# EAGLE design atmega16a_with_lcd (EAGLE 7.1.0)
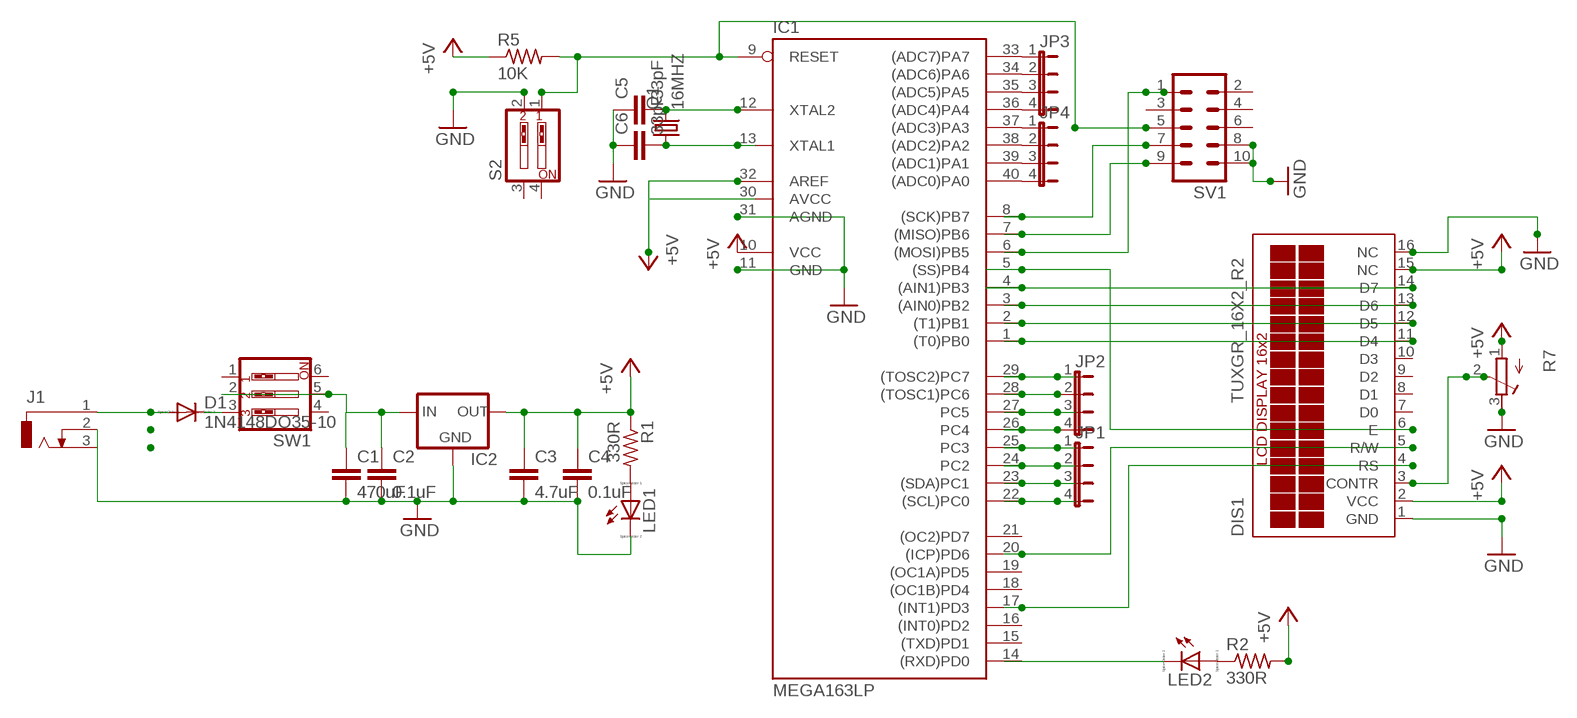
[diagram p0: schematic, sheet 1]

## Parts
C1  470uF  C2.5/4  [C2.5-4]
C2  0.1uF  C2.5/4  [C2.5-4]
C3  4.7uF  C2.5/4  [C2.5-4]
C4  0.1uF  C2.5/4  [C2.5-4]
C5  33pF  C2.5/4  [C2.5-4]
C6  33pF  C2.5/4  [C2.5-4]
D1  1N4148DO35-10  [DO35-10]
DIS1  TUXGR_16X2_R2  [TUXGR_16X2_R2]
IC1  MEGA163LP  [DIL40]
IC2  78XXS  [78XXS]
J1  DCJ0303  [DCJ0303]
JP1  JP4E  [JP4]
JP2  JP4E  [JP4]
JP3  JP4E  [JP4]
JP4  JP4E  [JP4]
LED1  LED_ELD260  [LED_LD260]
LED2  LED_ELD260  [LED_LD260]
Q1  16MHZ  CRYSTALHC49U-V  [HC49U-V]
R1  330R  R-US_0204/7  [0204/7]
R2  330R  R-US_0204/7  [0204/7]
R5  10K  R-US_0204/7  [0204/7]
R7  R-TRIMM3339P  [RTRIM3339P]
S2  SW_DIP-2  [EDG-02]
SV1  MA05-2  [MA05-2]
SW1  SW_DIP-3  [EDG-03]

## Nets
+5V: C3.1 C4.1 DIS1.2(VCC) DIS1.15(NC) IC1.10(VCC) IC1.32(AREF) IC2.OUT R1.1 R2.2 R5.1 R7.1(E)
GND: C1.2 C2.2 C3.2 C4.2 C5.1 C6.1 DIS1.1(GND) DIS1.16(NC) IC1.11(GND) IC1.31(AGND) IC2.GND J1.2 J1.3 LED1.K(C) R7.3(A) S2.2 SV1.8 SV1.10
N$1: D1.A J1.1
N$2: IC1.29((TOSC2)PC7) JP2.1
N$3: C5.2 IC1.12(XTAL2) Q1.2
N$4: C6.2 IC1.13(XTAL1) Q1.1
N$5: LED1.A R1.2
N$6: IC1.9(RESET) R5.2 S2.1 SV1.5
N$7: DIS1.3(CONTR) R7.2(S)
N$8: D1.C SW1.3
N$9: C1.1 C2.1 IC2.IN SW1.2 SW1.5
N$10: DIS1.11(D4) IC1.1((T0)PB0)
N$11: DIS1.12(D5) IC1.2((T1)PB1)
N$12: DIS1.13(D6) IC1.3((AIN0)PB2)
N$13: DIS1.14(D7) IC1.4((AIN1)PB3)
N$14: DIS1.4(RS) IC1.17((INT1)PD3)
N$15: DIS1.5(R/W) IC1.20((ICP)PD6)
N$16: DIS1.6(E) IC1.5((SS)PB4)
N$17: IC1.28((TOSC1)PC6) JP2.2
N$18: IC1.27(PC5) JP2.3
N$19: IC1.26(PC4) JP2.4
N$20: IC1.25(PC3) JP1.1
N$21: IC1.24(PC2) JP1.2
N$22: IC1.23((SDA)PC1) JP1.3
N$23: IC1.22((SCL)PC0) JP1.4
N$24: IC1.6((MOSI)PB5) SV1.1
N$25: IC1.7((MISO)PB6) SV1.9
N$26: IC1.8((SCK)PB7) SV1.7
N$27: IC1.14((RXD)PD0) LED2.K(C)
N$29: IC1.33((ADC7)PA7) JP3.1
N$30: IC1.34((ADC6)PA6) JP3.2
N$31: IC1.35((ADC5)PA5) JP3.3
N$32: IC1.36((ADC4)PA4) JP3.4
N$33: IC1.37((ADC3)PA3) JP4.1
N$34: IC1.38((ADC2)PA2) JP4.2
N$35: IC1.39((ADC1)PA1) JP4.3
N$36: IC1.40((ADC0)PA0) JP4.4
N$37: LED2.A R2.1
Unconnected: DIS1.7(D0) DIS1.8(D1) DIS1.9(D2) DIS1.10(D3) IC1.15((TXD)PD1) IC1.16((INT0)PD2) IC1.18((OC1B)PD4) IC1.19((OC1A)PD5) IC1.21((OC2)PD7) S2.3 S2.4 SV1.2 SV1.3 SV1.4 SV1.6 SW1.1 SW1.4 SW1.6

## Power pins joined to a net without a drawn wire
AVCC: IC1.30(AVCC)

## Library data of the parts
C1-C6 = capacitor-wima:C: CAPACITOR naming: grid - package width
D1 = diode:1N4148: DIODE high speed (Philips)
DIS1 = display-lcd:TUXGR_16X2_R2: Tuxgraphics LCD display 16x2 characters reflective, without background light Source: tuxgr_12x2_r2.pdf; OC_FARNELL: unknown; OC_NEWARK: unknown
IC1 = atmel:MEGA163*P: MICROCONTROLLER 16 Kbytes FLASH 1 Kbytes EEPROM 1 Kbytes SRAM UART 8-channel 10 bit ADC hardware multiplier Source: avr.lbr; OC_FARNELL: unknown; OC_NEWARK: unknown
IC2 = v-reg:78XXS: VOLTAGE REGULATOR
J1 = con-jack:DCJ0303: DC POWER JACK Source: DCJ0303.pdf; OC_FARNELL: unknown; OC_NEWARK: unknown
JP1-JP4 = jumper:JP4E: JUMPER
LED1 LED2 = eagle-ltspice:LED_E: LED Source: http://www.osram.convergy.de Source: www.luxeon.com Source: www.kingbright.com; SPICEMODEL: NONE; SPICEPREFIX: D; SPICETYPE: diode
Q1 = crystal:CRYSTAL: CRYSTAL; OC_FARNELL: 1666969; OC_NEWARK: unknown
R1 R2 R5 = resistor:R-US_: RESISTOR, American symbol
R7 = resistor:R-TRIMM: Trimm resistor
S2 = special:SW_DIP-2: DIP SWITCH
SV1 = con-lstb:MA05-2: PIN HEADER; OC_FARNELL: unknown; OC_NEWARK: unknown
SW1 = special:SW_DIP-3: DIP SWITCH

## Board
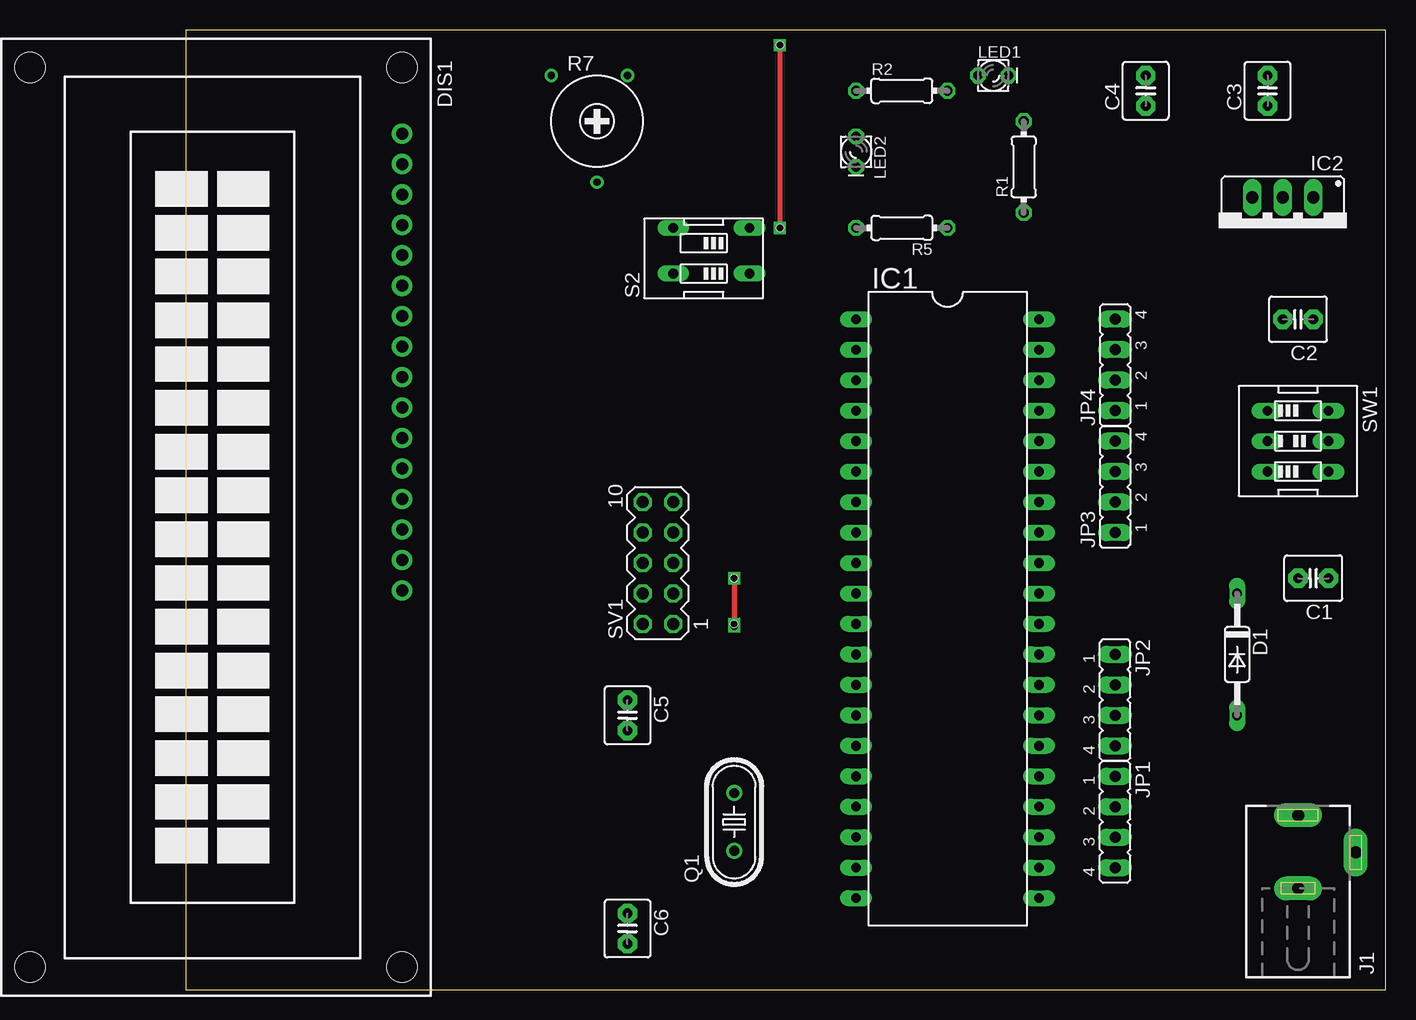
[diagram p1: board, top side]
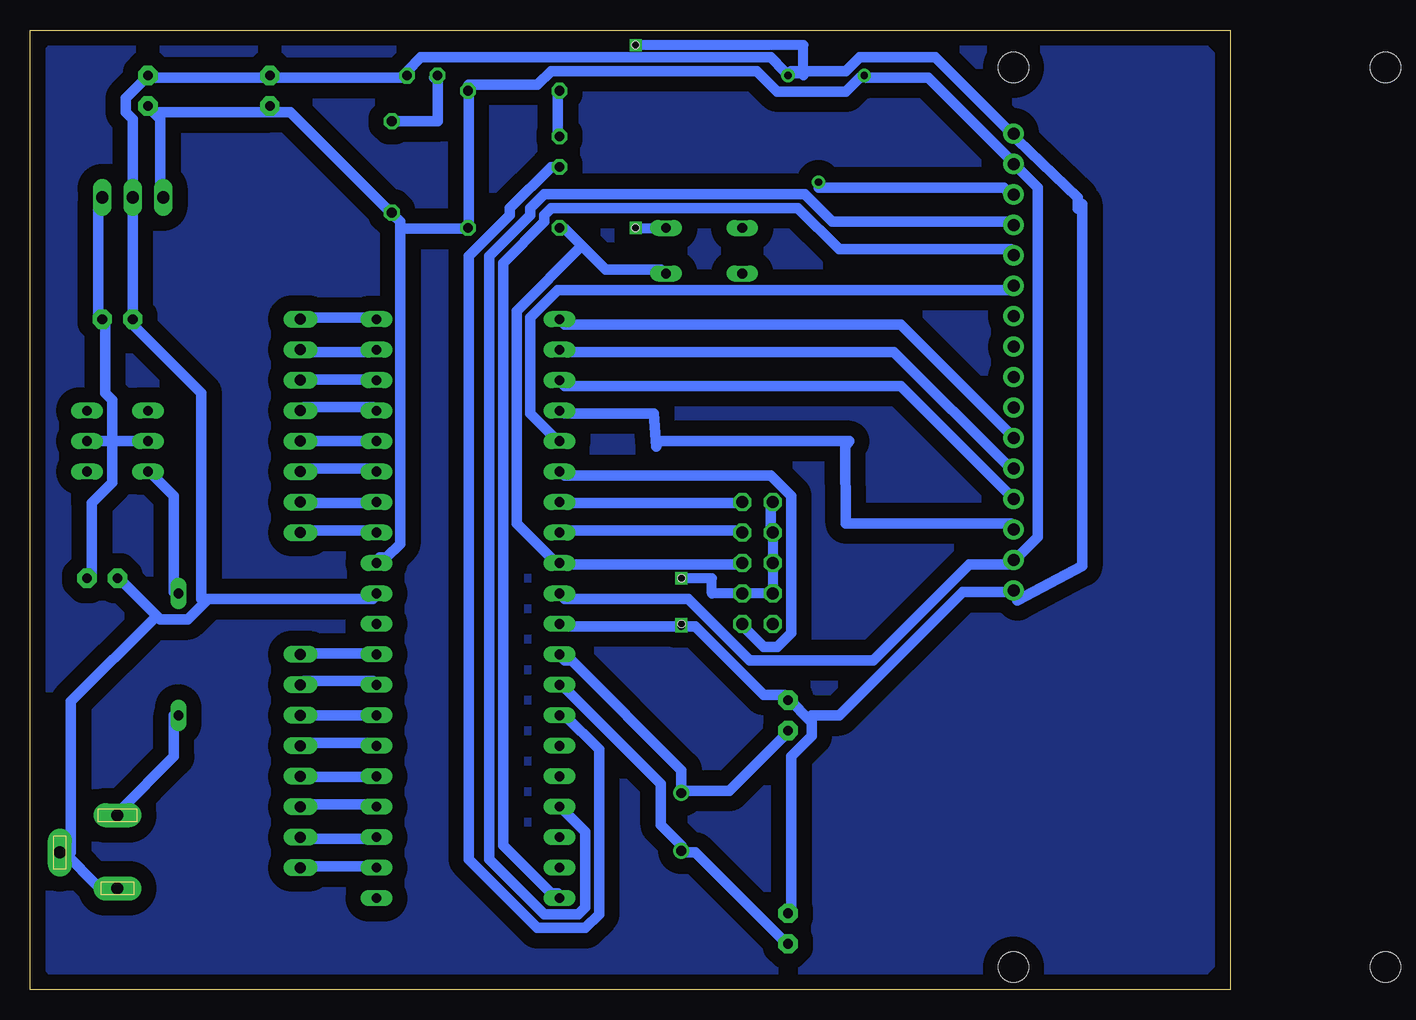
[diagram p2: board, bottom side, seen from below]

Size 100 x 80 mm. Coordinates in mm from the lower left corner, seen from the top.
Outline: 0,0 100,0 100,80 0,80 0,0
Copper layers (1*16): Top 0.035mm / dielectric 1.5mm / Bottom 0.035mm
Design rules "default *": minimum track width 35mil, minimum drill 24mil, track to track 10mil, track to pad 8mil, pad to pad 8mil, via to via 8mil, smd to smd 8mil, copper to edge 50mil, drill to drill 8mil, minimum pad ring 10mil, minimum via ring 8mil, stop-mask expansion 4mil, vias tented up to drill 0mil, thermal gap 10mil
Holes 0.6 mm at 45.72,30.48 45.72,34.29 49.53,63.5 49.53,78.74

### Footprints (pad centres in the part's own frame; a part is rotated, then mirrored left to right if it is on the bottom)
C2.5-4 = drill 0.813 pad 1.6 octagon: 1 -1.27,0; 2 1.27,0
DO35-10 = drill 0.813 long: A 5.08,0; C -5.08,0
TUXGR_16X2_R2 = drill 1 pad 1.676: 1 -32,15.5; 2 -29.46,15.5; 3 -26.92,15.5; 4 -24.38,15.5; 5 -21.84,15.5; 6 -19.3,15.5; 7 -16.76,15.5; 8 -14.22,15.5; 9 -11.68,15.5; 10 -9.14,15.5; 11 -6.6,15.5; 12 -4.06,15.5; 13 -1.52,15.5; 14 1.02,15.5; 15 3.56,15.5; 16 6.1,15.5 | hole 2.5: -37.5,-15.5; 37.5,-15.5; -37.5,15.5; 37.5,15.5
DIL40 = drill 0.813 long: 1 -24.13,-7.62; 2 -21.59,-7.62; 3 -19.05,-7.62; 4 -16.51,-7.62; 5 -13.97,-7.62; 6 -11.43,-7.62; 7 -8.89,-7.62; 8 -6.35,-7.62; 9 -3.81,-7.62; 10 -1.27,-7.62; 11 1.27,-7.62; 12 3.81,-7.62; 13 6.35,-7.62; 14 8.89,-7.62; 15 11.43,-7.62; 16 13.97,-7.62; 17 16.51,-7.62; 18 19.05,-7.62; 19 21.59,-7.62; 20 24.13,-7.62; 21 24.13,7.62; 22 21.59,7.62; 23 19.05,7.62; 24 16.51,7.62; 25 13.97,7.62; 26 11.43,7.62; 27 8.89,7.62; 28 6.35,7.62; 29 3.81,7.62; 30 1.27,7.62; 31 -1.27,7.62; 32 -3.81,7.62; 33 -6.35,7.62; 34 -8.89,7.62; 35 -11.43,7.62; 36 -13.97,7.62; 37 -16.51,7.62; 38 -19.05,7.62; 39 -21.59,7.62; 40 -24.13,7.62
78XXS = drill 1.016 long: GND 0,-2.54; IN -2.54,-2.54; OUT 2.54,-2.54
DCJ0303 = drill 1 pad 2 long: 1 0,3.1; 2 4.8,0; 3 0,-3
JP4 = drill 0.914 long: 1 -3.81,0; 2 -1.27,0; 3 1.27,0; 4 3.81,0
LED_LD260 = drill 0.813 octagon: A -1.27,0; K 1.27,0
HC49U-V = drill 0.813: 1 -2.413,0; 2 2.413,0
0204/7 = drill 0.813 octagon: 1 -3.81,0; 2 3.81,0
RTRIM3339P = drill 0.61: 1 -3.81,3.81; 2 0,-5.08; 3 2.54,3.81
EDG-02 = drill 0.813 long: 1 -1.27,-3.81; 2 2.54,-3.81; 3 2.54,2.54; 4 -1.27,2.54
MA05-2 = drill 1.016 octagon: 1 -5.08,-1.27; 2 -5.08,1.27; 3 -2.54,-1.27; 4 -2.54,1.27; 5 0,-1.27; 6 0,1.27; 7 2.54,-1.27; 8 2.54,1.27; 9 5.08,-1.27; 10 5.08,1.27
EDG-03 = drill 0.813 long: 1 -2.54,-2.54; 2 0,-2.54; 3 2.54,-2.54; 4 2.54,2.54; 5 0,2.54; 6 -2.54,2.54

### Placement (x,y rotation side)
C1  93.98,34.29 180 top
C2  92.71,55.88 180 top
C3  90.17,74.93 90 top
C4  80.01,74.93 90 top
C5  36.83,22.86 270 top
C6  36.83,5.08 270 top
D1  87.63,27.94 270 top
DIS1  2.54,39.37 270 top
IC1  63.5,31.75 270 top
IC2  91.44,63.5 180 top
J1  92.71,11.43 0 top
JP1  77.47,13.97 270 top
JP2  77.47,24.13 270 top
JP3  77.47,41.91 90 top
JP4  77.47,52.07 90 top
LED1  67.31,76.2 0 top
LED2  55.88,69.85 270 top
Q1  45.72,13.97 90 top
R1  69.85,68.58 90 top
R2  59.69,74.93 0 top
R5  59.69,63.5 180 top
R7  34.29,72.39 0 top
S2  43.18,60.96 90 top
SV1  39.37,35.56 90 top
SW1  92.71,45.72 270 top

### Tracks (layer width: path | path; a pad name or v marks a point on that pad's centre or on a via)
+5V
  Bottom 0.889: 89.44,72.87 89.72,73.15 C3.1 | 89.44,72.87 89.15,72.58 89.15,66.29 IC2.OUT | 80.01,73.15 89.15,73.15 89.44,72.87 | 69.15,63.44 69.15,64.01 69.72,64.58 R1.1 70.29,65.15 78.3,73.15 80.01,73.15 | 69.15,63.44 69.15,37.15 70.29,36.01 70.87,36.01 IC1.32 | 69.15,63.44 64.01,63.44 R5.1 63.44,64.01 63.44,74.87 R2.2 63.44,75.44 57.72,75.44 56.58,76.58 39.43,76.58 37.72,74.87 32,74.87 30.86,76.01 R7.1 30.29,76.01 25.15,76.01 18.29,69.15 DIS1.2 17.72,68.58 16,66.86 16,37.72 17.72,36.01 DIS1.15 18.29,35.43 21.72,35.43 29.72,27.43 40.01,27.43 45.15,32.58 55.44,32.58 IC1.10 | 80.01,73.15 C4.1
GND  (via drill 0.6)
  Top 0.406: v45.72,34.29 v45.72,30.48 v45.72,30.29 | v49.53,78.74 v49.53,63.5
  Bottom 0.406: R7.3 35.56,76.2
  Bottom 0.813: SV1.8 38.1,33.02 43.18,33.02 43.18,34.29 v45.72,34.29 | 35.56,76.2 35.56,78.74 v49.53,78.74 | v49.53,63.5 S2.2
  Bottom 0.889: IC1.11 55.44,30.29 v45.72,30.29 44.58,30.29 38.86,24.57 37.15,24.57 C5.1 36.58,24 35.15,22.57 | 35.15,22.57 34.86,22.29 34.86,21.14 36.58,19.43 36.58,6.86 C6.1 | 35.15,22.57 34.86,22.86 32.58,22.86 22.29,33.15 18.29,33.15 DIS1.16 17.72,32.45 12.32,35.31 12.32,65.47 arc-90 12.7,65.09 12.7,66.04 17.72,70.87 DIS1.1 18.29,71.44 24.57,77.72 30.86,77.72 32,76.58 36.58,76.58 R7.3 37.15,76.58 38.29,77.72 67.44,77.72 68.58,76.58 LED1.K 68.58,76.01 80.01,76.01 | J1.3 93.15,8.57 94.3,8.57 97.16,11.43 J1.2 96.58,11.43 96.58,24 89.44,31.15 | 85.44,32.29 86.87,30.86 89.15,30.86 89.44,31.15 | 85.44,32.29 85.15,32.58 71.44,32.58 IC1.31 | 89.44,31.15 92.58,34.29 C1.2 | 80.01,76.01 89.72,76.01 C3.2 90.3,76.01 92.01,74.3 92.01,73.15 91.44,72.58 IC2.GND C2.2 91.44,55.44 85.72,49.72 85.72,32.58 85.44,32.29 | 80.01,76.01 C4.2 | SV1.8 38.29,38.29 38.29,40.58 SV1.10
N$1
  Bottom 0.889: D1.A 88.01,22.86 88.01,19.43 92.58,14.86 J1.1
N$2
  Bottom 0.889: IC1.29 71.44,28 77.15,28 JP2.1
N$3
  Bottom 0.889: 45.72,16.57 41.72,16.57 37.15,21.14 C5.2 | 45.72,16.57 45.72,18.29 54.86,27.43 55.44,27.43 IC1.12 | 45.72,16.57 Q1.2
N$4
  Bottom 0.889: C6.2 37.15,4 44.58,11.43 45.72,11.43 Q1.1 45.72,12 47.43,13.72 47.43,17.14 55.44,25.15 IC1.13
N$5
  Bottom 0.889: R1.2 69.72,72.58 R1.2 | R1.2 66.04,72.39 66.04,75.75 arc-90 66.29,76.01 LED1.A
N$6
  Bottom 0.889: 54.01,62.01 55.44,63.44 R5.2 | 54.01,62.01 52.01,60.01 47.43,60.01 S2.1 | SV1.5 41.15,35.43 55.44,35.43 IC1.9 56.01,35.43 59.44,38.86 59.44,56.58 54.01,62.01
N$7
  Bottom 0.889: R7.2 34.29,66.86 18.86,66.86 18.29,66.29 DIS1.3
N$8
  Bottom 0.889: D1.C 88.01,33.15 88.01,41.15 89.72,42.86 SW1.3
N$9
  Bottom 0.889: IC2.IN 94.3,65.72 94.3,56.01 C2.1 93.73,55.44 93.73,49.72 93.15,49.15 93.15,45.72 | SW1.5 93.15,45.72 | 93.15,45.72 SW1.2 | 93.15,45.72 93.15,42.29 94.87,40.58 94.87,34.29 C1.1
N$10
  Bottom 0.889: IC1.1 55.44,55.44 27.43,55.44 18.29,46.29 DIS1.11
N$11
  Bottom 0.889: IC1.2 55.44,53.15 28,53.15 18.29,43.43 DIS1.12
N$12
  Bottom 0.889: IC1.3 55.44,50.29 27.43,50.29 18.29,41.15 DIS1.13
N$13
  Bottom 0.889: IC1.4 55.44,48.01 48.01,48.01 47.82,45.28 arc90 47.37,45.72 31.75,45.72 32.07,45.28 32,38.86 18.29,38.86 DIS1.14
N$14
  Bottom 0.889: IC1.17 55.44,14.86 53.72,13.14 53.72,6.86 54.29,6.29 57.15,6.29 61.72,10.86 61.72,61.15 58.29,64.58 58.29,65.15 57.15,66.29 35.43,66.29 33.15,64.01 18.29,64.01 DIS1.4
N$15
  Bottom 0.889: IC1.20 56.01,8 56.58,8 60.58,12 60.58,60.58 57.15,64.01 57.15,64.58 56.58,65.15 36.01,65.15 32.58,61.72 18.29,61.72 DIS1.5
N$16
  Bottom 0.889: IC1.5 56.01,45.72 58.29,48.01 58.29,56.01 56.01,58.29 18.29,58.29 DIS1.6
N$17
  Bottom 0.889: IC1.28 71.44,25.72 77.15,25.72 JP2.2
N$18
  Bottom 0.889: JP2.3 IC1.27
N$19
  Bottom 0.889: IC1.26 71.44,20.57 77.15,20.57 JP2.4
N$20
  Bottom 0.889: IC1.25 71.44,17.72 77.15,17.72 JP1.1
N$21
  Bottom 0.889: IC1.24 71.44,15.43 77.15,15.43 JP1.2
N$22
  Bottom 0.889: IC1.23 71.44,12.57 77.15,12.57 JP1.3
N$23
  Bottom 0.889: IC1.22 71.44,10.29 77.15,10.29 JP1.4
N$24
  Bottom 0.889: IC1.6 55.44,42.86 38.29,42.86 36.58,41.15 36.58,29.72 37.72,28.57 38.86,28.57 40.58,30.29 SV1.1
N$25
  Bottom 0.889: IC1.7 55.44,40.58 41.15,40.58 SV1.9
N$26
  Bottom 0.889: IC1.8 55.44,38.29 41.15,38.29 SV1.7
N$27
  Bottom 0.889: LED2.K 56.58,68.58 60.01,65.15 60.01,64.58 63.44,61.15 63.44,10.86 57.72,5.14 53.72,5.14 52.58,6.29 52.58,20 55.44,22.86 IC1.14
N$28
  pour Bottom (isolate 1.27): 6.35,0 arc-90 0,6.35 0,73.66 arc-90 6.35,80.01 8.89,80.01 93.98,80.01 arc-90 100.33,73.66 100.33,6.35 arc-90 93.98,0 91.44,0
N$29
  Bottom 0.889: IC1.33 71.44,38.29 77.15,38.29 JP3.1
N$30
  Bottom 0.889: IC1.34 71.44,40.58 77.15,40.58 JP3.2
N$31
  Bottom 0.889: IC1.35 71.44,43.43 77.15,43.43 JP3.3
N$32
  Bottom 0.889: JP3.4 IC1.36
N$33
  Bottom 0.889: IC1.37 71.44,48.58 77.15,48.58 JP4.1
N$34
  Bottom 0.889: IC1.38 71.44,50.86 77.15,50.86 JP4.2
N$35
  Bottom 0.889: IC1.39 71.44,53.15 77.15,53.15 JP4.3
N$36
  Bottom 0.889: IC1.40 71.44,56.01 77.15,56.01 JP4.4
N$37
  Bottom 0.889: LED2.A 56.01,71.44 56.01,74.87 R2.1